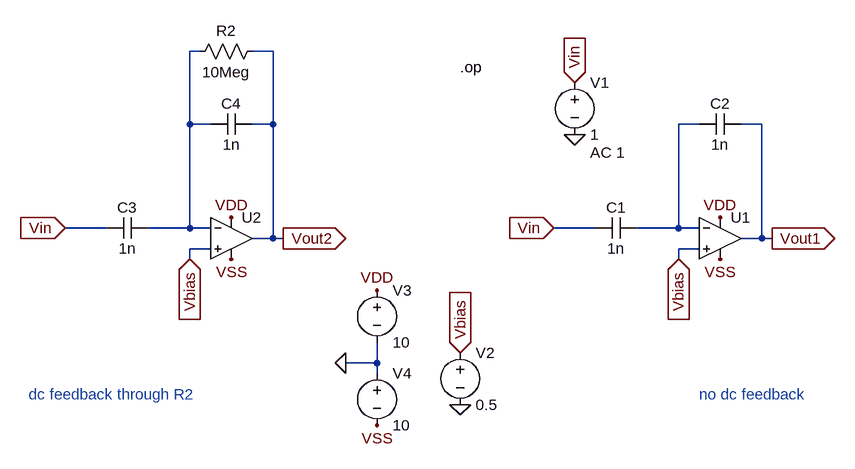
[diagram p0: schematic capacitive inverting config.asc]
capacitive inverting config.asc, the LTspice schematic file:
Version 4
SHEET 1 1184 700
WIRE 176 -304 160 -304
WIRE 288 -304 256 -304
WIRE 160 -192 160 -304
WIRE 192 -192 160 -192
WIRE 288 -192 288 -304
WIRE 288 -192 256 -192
WIRE 944 -192 912 -192
WIRE 1040 -192 1008 -192
WIRE 32 -32 -32 -32
WIRE 160 -32 160 -192
WIRE 160 -32 96 -32
WIRE 192 -32 160 -32
WIRE 784 -32 720 -32
WIRE 912 -32 912 -192
WIRE 912 -32 848 -32
WIRE 944 -32 912 -32
WIRE 288 -16 288 -192
WIRE 288 -16 256 -16
WIRE 304 -16 288 -16
WIRE 1040 -16 1040 -192
WIRE 1040 -16 1008 -16
WIRE 1056 -16 1040 -16
WIRE 192 0 160 0
WIRE 944 0 912 0
WIRE 160 16 160 0
WIRE 912 16 912 0
WIRE 448 176 448 144
WIRE 448 176 400 176
WIRE 448 192 448 176
FLAG 720 -32 Vin
IOPIN 720 -32 In
FLAG 1056 -16 Vout1
IOPIN 1056 -16 Out
FLAG 752 -176 0
FLAG 752 -256 Vin
IOPIN 752 -256 In
FLAG 576 240 0
FLAG 576 160 Vbias
IOPIN 576 160 In
FLAG 912 16 Vbias
IOPIN 912 16 In
FLAG 400 176 0
FLAG 448 64 VDD
FLAG 448 272 VSS
FLAG 976 16 VSS
FLAG 976 -48 VDD
FLAG -32 -32 Vin
IOPIN -32 -32 In
FLAG 304 -16 Vout2
IOPIN 304 -16 Out
FLAG 160 16 Vbias
IOPIN 160 16 In
FLAG 224 16 VSS
FLAG 224 -48 VDD
SYMBOL Opamps\\UniversalOpamp2 976 -16 R0
SYMATTR InstName U1
SYMBOL cap 848 -48 R90
WINDOW 0 0 32 VBottom 2
WINDOW 3 32 32 VTop 2
SYMATTR InstName C1
SYMATTR Value 1n
SYMBOL cap 1008 -208 R90
WINDOW 0 0 32 VBottom 2
WINDOW 3 32 32 VTop 2
SYMATTR InstName C2
SYMATTR Value 1n
SYMBOL voltage 752 -272 R0
WINDOW 123 24 124 Left 2
WINDOW 39 0 0 Left 0
SYMATTR Value2 AC 1
SYMATTR InstName V1
SYMATTR Value 1
SYMBOL voltage 576 144 R0
WINDOW 123 24 124 Left 2
WINDOW 39 0 0 Left 0
SYMATTR InstName V2
SYMATTR Value 0.5
SYMBOL voltage 448 48 R0
WINDOW 123 0 0 Left 0
WINDOW 39 0 0 Left 0
SYMATTR InstName V3
SYMATTR Value 10
SYMBOL voltage 448 176 R0
WINDOW 123 0 0 Left 0
WINDOW 39 0 0 Left 0
SYMATTR InstName V4
SYMATTR Value 10
SYMBOL Opamps\\UniversalOpamp2 224 -16 R0
SYMATTR InstName U2
SYMBOL cap 96 -48 R90
WINDOW 0 0 32 VBottom 2
WINDOW 3 32 32 VTop 2
SYMATTR InstName C3
SYMATTR Value 1n
SYMBOL cap 256 -208 R90
WINDOW 0 0 32 VBottom 2
WINDOW 3 32 32 VTop 2
SYMATTR InstName C4
SYMATTR Value 1n
SYMBOL res 272 -320 R90
WINDOW 0 0 56 VBottom 2
WINDOW 3 32 56 VTop 2
SYMATTR InstName R2
SYMATTR Value 10Meg
TEXT 576 -280 Left 2 !.op
TEXT 944 224 Left 2 ;no dc feedback
TEXT -88 224 Left 2 ;dc feedback through R2

The netlist it stands for:
* capacitive inverting config.asc
XU1 Vbias N002 VDD VSS Vout1 level.2 Avol=1Meg GBW=10Meg Slew=10Meg ilimit=25m rail=0 Vos=0 phimargin=45 en=0 enk=0 in=0 ink=0 Rin=500Meg  ; pins IN+ IN- V+ V- OUT
C1 N002 Vin 1n
C2 Vout1 N002 1n
V1 Vin 0 1 AC 1
V2 Vbias 0 0.5
V3 VDD 0 10
V4 0 VSS 10
XU2 Vbias N001 VDD VSS Vout2 level.2 Avol=1Meg GBW=10Meg Slew=10Meg ilimit=25m rail=0 Vos=0 phimargin=45 en=0 enk=0 in=0 ink=0 Rin=500Meg  ; pins IN+ IN- V+ V- OUT
C3 N001 Vin 1n
C4 Vout2 N001 1n
R2 Vout2 N001 10Meg
.op
* no dc feedback
* dc feedback through R2
.lib UniversalOpamps2.sub
.backanno
.end